# EAGLE design back panel (EAGLE 9.6.2)
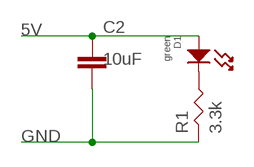
[diagram p0: schematic, sheet 1]

## Parts
C2  10uF  CAPACITOR_0805_N  [RESC0805_N]
D1  green  LED_SINGLE-0805  [LED0805]
R1  3.3k  RES-0402  [RES-0402]

## Nets
5V: C2.1 D1.ANODE
GND: C2.2 R1.P$1
N$7: D1.CATHODE R1.P$2

## Library data of the parts
C2 = Nordic_nRF:CAPACITOR: Generic chip capacitor
D1 = MF_LEDs:LED_SINGLE: Library: MF_LEDs Description: Device for Single LED Packages. Manufacture part number (MFG#) can be added via Attributes.; HOUSEPART: NO; POPULATE: 1
R1 = FlashPCB_Resistors:RES-0402: https://www.digikey.com/en/products/filter/chip-resistor-surface-mount/52?s=N4IgjCBcpgbFoDGUBmBDANgZwKYBoQB7KAbRAGYBOAJgBZ4BdAgBwBcoQBlVgJwEsAdgHMQAX1EFqpEDxxY%2BWVoR4gGooA

## Net classes
0 default: width 0.305 mm
1 power: width 0.406 mm
2 gnd: width 0.305 mm

## Board
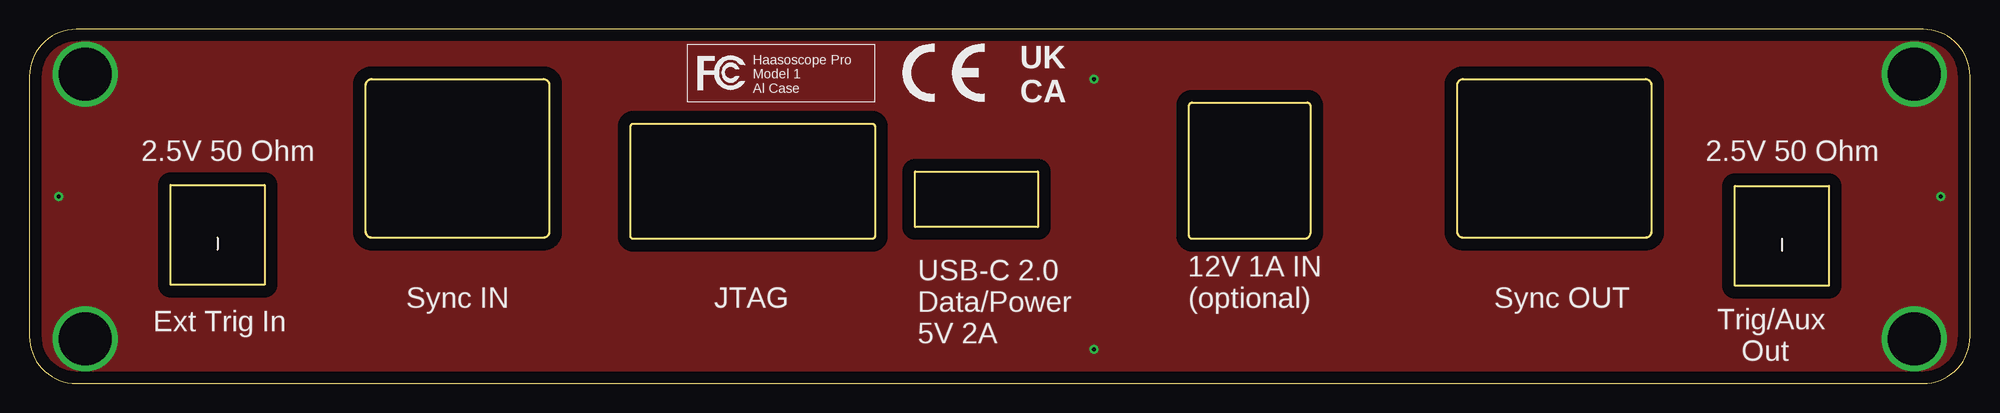
[diagram p1: board, top side]
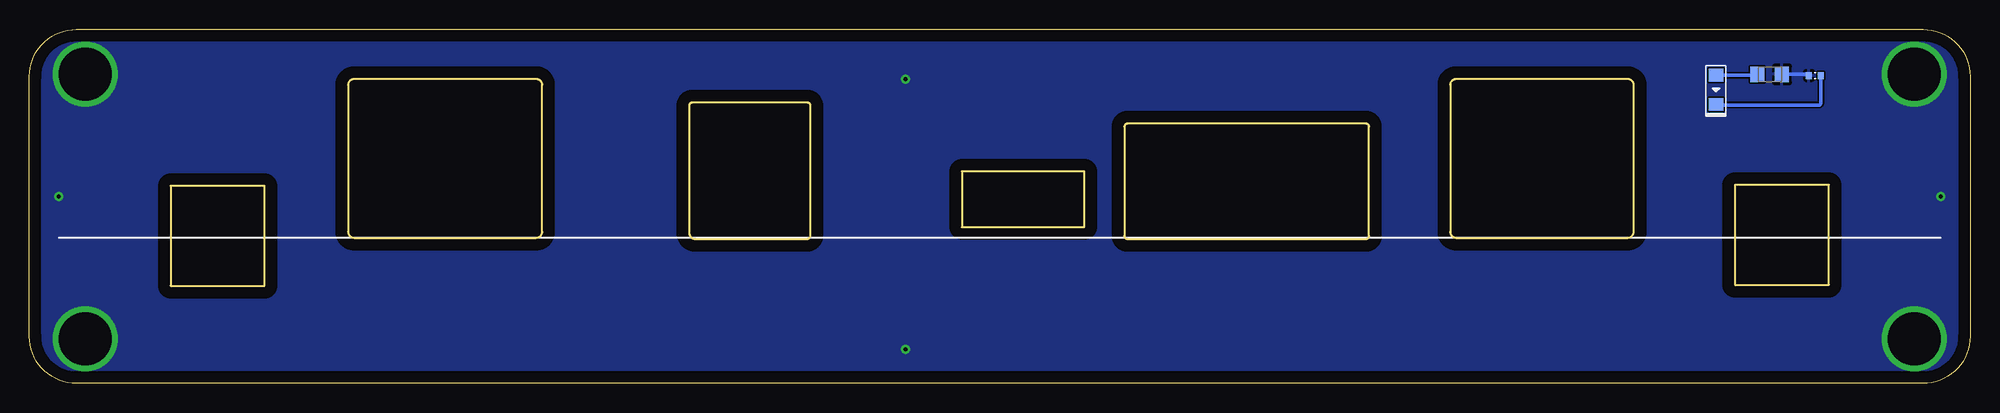
[diagram p2: board, bottom side, seen from below]

Size 165 x 30.13 mm. Coordinates in mm from the lower left corner, seen from the top.
Outline: 0,26.13 0,4 arc90 4,0 161,0 arc90 165,4 165,26.13 arc90 161,30.13 4,30.13 arc90 0,26.13
Outline: 75.3,18.05 85.73,18.05 85.73,13.3 75.3,13.3 75.3,18.05
Outline: 71.9,21.85 71.9,12.55 arc-90 71.65,12.3 51.35,12.3 arc-90 51.1,12.55 51.1,21.85 arc-90 51.35,22.1 71.65,22.1 arc-90 71.9,21.85
Outline: 43.7,12.4 29.1,12.4 arc-90 28.6,12.9 28.6,25.4 arc-90 29.1,25.9 43.7,25.9 arc-90 44.2,25.4 44.2,12.9 arc-90 43.7,12.4
Outline: 121.4,12.9 121.4,25.4 arc-90 121.9,25.9 137.4,25.9 arc-90 137.9,25.4 137.9,12.9 arc-90 137.4,12.4 121.9,12.4 arc-90 121.4,12.9
Outline: 108.4,12.3 98.85,12.3 arc-90 98.6,12.55 98.6,23.65 arc-90 98.85,23.9 108.65,23.9 arc-90 108.9,23.65 108.9,12.8 arc-90 108.4,12.3
Outline: 20,8.4 12,8.4 12,16.9 20,16.9 20,8.4
Outline: 153,8.3 145,8.3 145,16.8 153,16.8 153,8.3
Copper layers (1*16): Top 0.035mm / dielectric 1.5mm / Bottom 0.035mm
Design rules "default": minimum track width 6mil, minimum drill 0.35mm, track to track 6mil, track to pad 6mil, pad to pad 6mil, via to via 6mil, smd to smd 6mil, copper to edge 40mil, drill to drill 6mil, minimum pad ring 10mil, minimum via ring 8mil, stop-mask expansion 4mil, vias tented up to drill 0mil, thermal gap 10mil

### Footprints (pad centres in the part's own frame; a part is rotated, then mirrored left to right if it is on the bottom)
RESC0805_N = smd 1.2 x 1.35: 1 -1.1,0; 2 1,0
LED0805 = smd 1.1 x 1.25: ANODE 1.25,0; CATHODE -1.25,0
RES-0402 = smd 0.5 x 0.6: P$1 -0.5,0; P$2 0.5,0

### Placement (x,y rotation side)
C2  17,26.3 0 bottom
D1  21.6,25 90 bottom
R1  13.2,26.2 0 bottom
U$1  [CE_5MM]  74.2,23.9 0 top
U$2  [FCC_6.1X16MM]  55.9,23.9 0 top

### Tracks (layer width: path | path; a pad name or v marks a point on that pad's centre or on a via)
5V
  Bottom 0.305: D1.ANODE 18.15,26.25 C2.1
GND  (via drill 0.35, 4.5)
  Bottom 0.305: C2.2 13.8,26.3 R1.P$1
  other vias: 2.5,15.9 162.5,15.9 90.5,25.9 90.5,2.9 160.25,26.33 160.25,3.8 4.75,3.8 4.75,26.33
  pour Bottom: -0.6,31.2 -0.6,-1.2 0,-1.8 166.2,-1.8 166.7,-1.3 166.7,29.2 164.7,31.2
  pour Top: -0.6,31 -0.6,-1.4 0,-2 166.2,-2 166.7,-1.5 166.7,29 164.7,31
N$7
  Bottom 0.305: R1.P$2 12.7,23.8 12.8,23.7 21.55,23.7 D1.CATHODE

### Text on the board
tPlace: Haasoscope Pro / Model 1 / Al Case | UK / CA | 2.5V 50 Ohm | 2.5V 50 Ohm | Sync IN | JTAG | 12V 1A IN / (optional) | Sync OUT | Ext Trig In | USB-C 2.0 / Data/Power / 5V 2A | Trig/Aux / Out